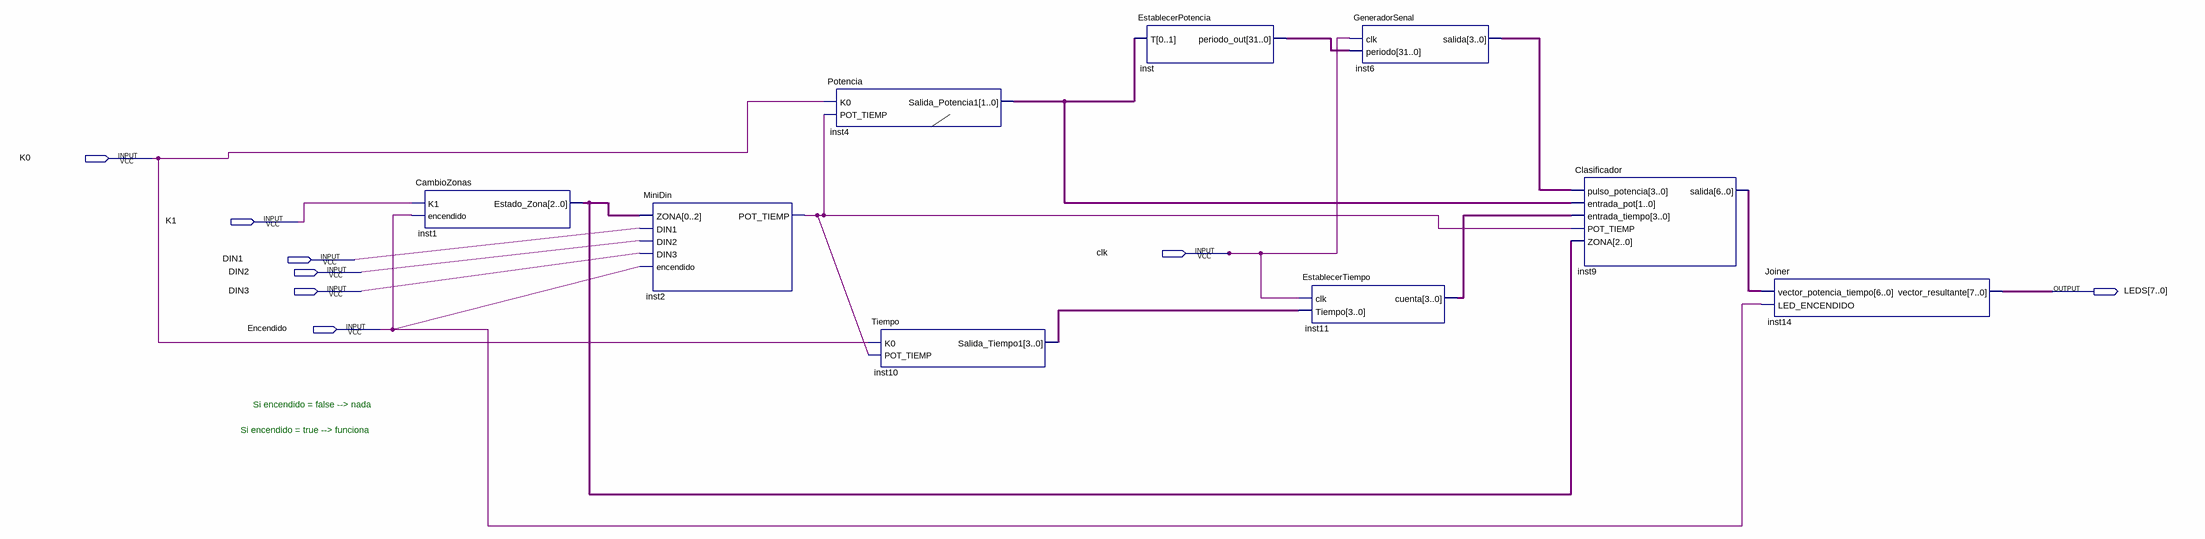
[diagram p0: schematic sheet]
// Quartus schematic PlacaDeInduccion.bdf as structural Verilog: 9 symbols, 8 pins
module PlacaDeInduccion (
  input  K0,
  input  K1,
  input  clk,
  input  DIN1,
  input  DIN2,
  input  DIN3,
  input  Encendido,
  output [7:0] LEDS
);

  wire inst2_pot_tiemp;
  wire [1:0] inst4_salida_potencia1;
  wire [2:0] inst1_estado_zona;
  wire [3:0] inst6_salida, inst10_salida_tiempo1, inst11_cuenta;
  wire [6:0] inst9_salida;
  wire [31:0] inst_periodo_out;

  CambioZonas inst1 (.K1(K1), .encendido(Encendido), .Estado_Zona(inst1_estado_zona));
  MiniDin inst2 (
    .ZONA(inst1_estado_zona), .DIN1(DIN1), .DIN2(DIN2), .DIN3(DIN3), .encendido(Encendido),
    .POT_TIEMP(inst2_pot_tiemp));
  Potencia inst4 (.K0(K0), .POT_TIEMP(inst2_pot_tiemp), .Salida_Potencia1(inst4_salida_potencia1));
  Tiempo inst10 (.K0(K0), .POT_TIEMP(inst2_pot_tiemp), .Salida_Tiempo1(inst10_salida_tiempo1));
  EstablecerPotencia inst (.T(inst4_salida_potencia1), .periodo_out(inst_periodo_out));
  EstablecerTiempo inst11 (.clk(clk), .Tiempo(inst10_salida_tiempo1), .cuenta(inst11_cuenta));
  GeneradorSenal inst6 (.clk(clk), .periodo(inst_periodo_out), .salida(inst6_salida));
  Clasificador inst9 (
    .pulso_potencia(inst6_salida), .entrada_pot(inst4_salida_potencia1), .entrada_tiempo(inst11_cuenta),
    .POT_TIEMP(inst2_pot_tiemp), .ZONA(inst1_estado_zona), .salida(inst9_salida));
  Joiner inst14 (.vector_potencia_tiempo(inst9_salida), .LED_ENCENDIDO(Encendido), .vector_resultante(LEDS));

  // Notes on the sheet:
  //   Si encendido = false --> nada
  //   Si encendido = true --> funciona
endmodule
